# Altium schematic sheet CAN.SchDoc
size A; SheetNumber: 2; SheetTotal: 6
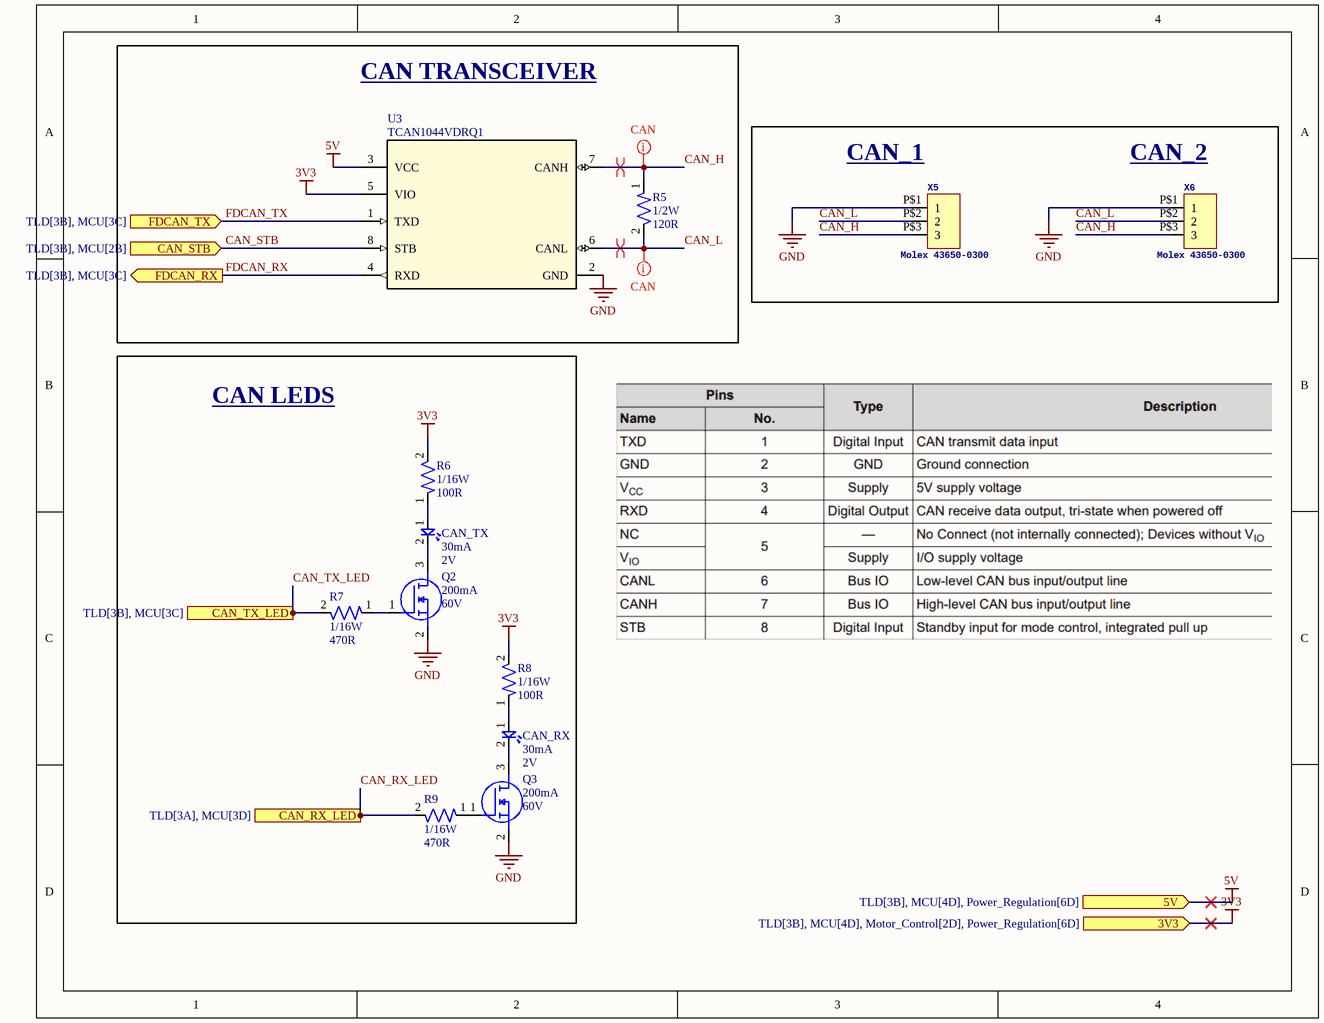
[diagram p0: CAN.SchDoc]

## Parts
CAN_RX  Forward Current: 30mA  Forward Voltage: 2V  [LED-0603]  (hidden comment: BL-HKC36G-AV-TRB)
CAN_TX  Forward Current: 30mA  Forward Voltage: 2V  [LED-0603]  (hidden comment: BL-HKC36G-AV-TRB)
Q2  Continuous Current: 200mA  Voltage: 60V  [IC-SOT23-3]  (hidden comment: T2N7002AK,LM)
Q3  Continuous Current: 200mA  Voltage: 60V  [IC-SOT23-3]  (hidden comment: T2N7002AK,LM)
R5  Power: 1/2W  Resistance: 120R  [RES-1210]  (hidden comment: RC1210FR-07120RL)
R6  Power: 1/16W  Resistance: 100R  [RES-0402]  (hidden comment: RC0402FR-07100RL)
R7  Power: 1/16W  Resistance: 470R  [RES-0402]  (hidden comment: RC0402FR-07470RL)
R8  Power: 1/16W  Resistance: 100R  [RES-0402]  (hidden comment: RC0402FR-07100RL)
R9  Power: 1/16W  Resistance: 470R  [RES-0402]  (hidden comment: RC0402FR-07470RL)
U3  TCAN1044VDRQ1  [IC-8SOIC]
X5  Molex 43650-0300  [43650-0300]
X6  Molex 43650-0300  [43650-0300]

## Blocks framed on the sheet
CAN TRANSCEIVER: R5 U3
CAN LEDS: CAN_RX CAN_TX Q2 Q3 R6-R9

## Ports
3V3 (in, see TLD[3B], MCU[4D], Motor_Control[2D], Power_Regulation[6D]), 5V (in, see TLD[3B], MCU[4D], Power_Regulation[6D]), CAN_RX_LED (in, see TLD[3A], MCU[3D]), CAN_STB (in, see TLD[3B], MCU[2B]), CAN_TX_LED (in, see TLD[3B], MCU[3C]), FDCAN_RX (out, see TLD[3B], MCU[3C]), FDCAN_TX (in, see TLD[3B], MCU[3C])

## Nets
3V3: R6.2 R8.2 U3.5(VIO) ; port 3V3
5V: U3.3(VCC) ; port 5V
GND: Q2.2(S) Q3.2(S) U3.2(GND) X5.P$1(1) X6.P$1(1)
CAN_H: R5.1 U3.7(CANH) X5.P$3(3) X6.P$3(3)
CAN_L: R5.2 U3.6(CANL) X5.P$2(2) X6.P$2(2)
CAN_RX_LED: R9.2 ; port CAN_RX_LED
CAN_STB: U3.8(STB) ; port CAN_STB
CAN_TX_LED: R7.2 ; port CAN_TX_LED
FDCAN_RX: U3.4(RXD) ; port FDCAN_RX
FDCAN_TX: U3.1(TXD) ; port FDCAN_TX
NetCAN_RX_1: CAN_RX.1 R8.1
NetCAN_RX_2: CAN_RX.2 Q3.3(D)
NetCAN_TX_1: CAN_TX.1 R6.1
NetCAN_TX_2: CAN_TX.2 Q2.3(D)
NetQ2_1: Q2.1(G) R7.1
NetQ3_1: Q3.1(G) R9.1

## Layout directives
differential pair; differential pair class CAN: CAN_H, CAN_L
mark named CAN: CAN_H, CAN_L

## Notes on the sheet
- (near X5) CAN_1
- (near X6) CAN_2

## Library data of the parts
CAN_RX CAN_TX = LED-0001: LED YELLOW CLEAR 0603 SMD; ComponentLink1Description: Datasheet; ComponentLink1URL: https://www.americanbrightled.com/pdffiles/led-components/smt/BL-HKC36G-AV-TRB.pdf
Q2 Q3 = NMOS-200MA-0001: MOSFET N-CH 60V 200MA SOT23; ComponentLink1Description: Datasheet; ComponentLink1URL: https://toshiba.semicon-storage.com/info/T2N7002AK_datasheet_en_20150401.pdf?did=29712&prodName=T2N7002AK
R5 = RES-120-0001: RES 120 OHM 1% 1/2W 1210; Tolerance: 1%; Size: 1210; ComponentLink1Description: Datasheet; ComponentLink1URL: https://www.yageo.com/upload/media/product/products/datasheet/rchip/PYu-RC_Group_51_RoHS_L_12.pdf
R6 R8 = RES-100-0001: RES 100 OHM 1% 1/16W 0402; Tolerance: 1%; Size: 0402; ComponentLink1Description: Datasheet; ComponentLink1URL: https://www.yageo.com/upload/media/product/products/datasheet/rchip/PYu-RC_Group_51_RoHS_L_12.pdf
R7 R9 = RES-470-0001: RES 470 OHM 1% 1/16W 0402; Tolerance: 1%; Size: 0402; ComponentLink1Description: Datasheet; ComponentLink1URL: https://www.yageo.com/upload/media/product/products/datasheet/rchip/PYu-RC_Group_51_RoHS_L_12.pdf
U3 = IC-CAN-0001: IC TRANSCEIVER 1/1 8SOIC; ComponentLink1Description: Datasheet; ComponentLink1URL: https://www.ti.com/lit/ds/symlink/tcan1044-q1.pdf?HQS=dis-dk-null-digikeymode-dsf-pf-null-wwe&ts=1728758303289&ref_url=https%253A%252F%252Fwww.ti.com%252Fgeneral%252Fdocs%252Fsuppproductinfo.tsp%253FdistId%253D10%2526gotoUrl%253Dhttps%253A%252F%252Fwww.ti.com%252Flit%252Fgpn%252Ftcan1044-q1
X5 X6 = Micro-Fit Molex 3 Pin Right Angle: GateName_1: G$1; SymbolName_1: HEADER_POS3; DeviceSetName: HEADER_POS3_?; DeviceName: 43650-0300; LibraryName: con-molex-micro-fit-3_0_2; Package: 43650-0300